# Altium schematic sheet Micro-Controller Unit.SchDoc: Micro Controller Unit
size A3; DrawnBy: Adrien Dos SANTOS; Organization: Altium Limited; Revision: revision; SheetNumber: 2; SheetTotal: 5; ProjectName: projname
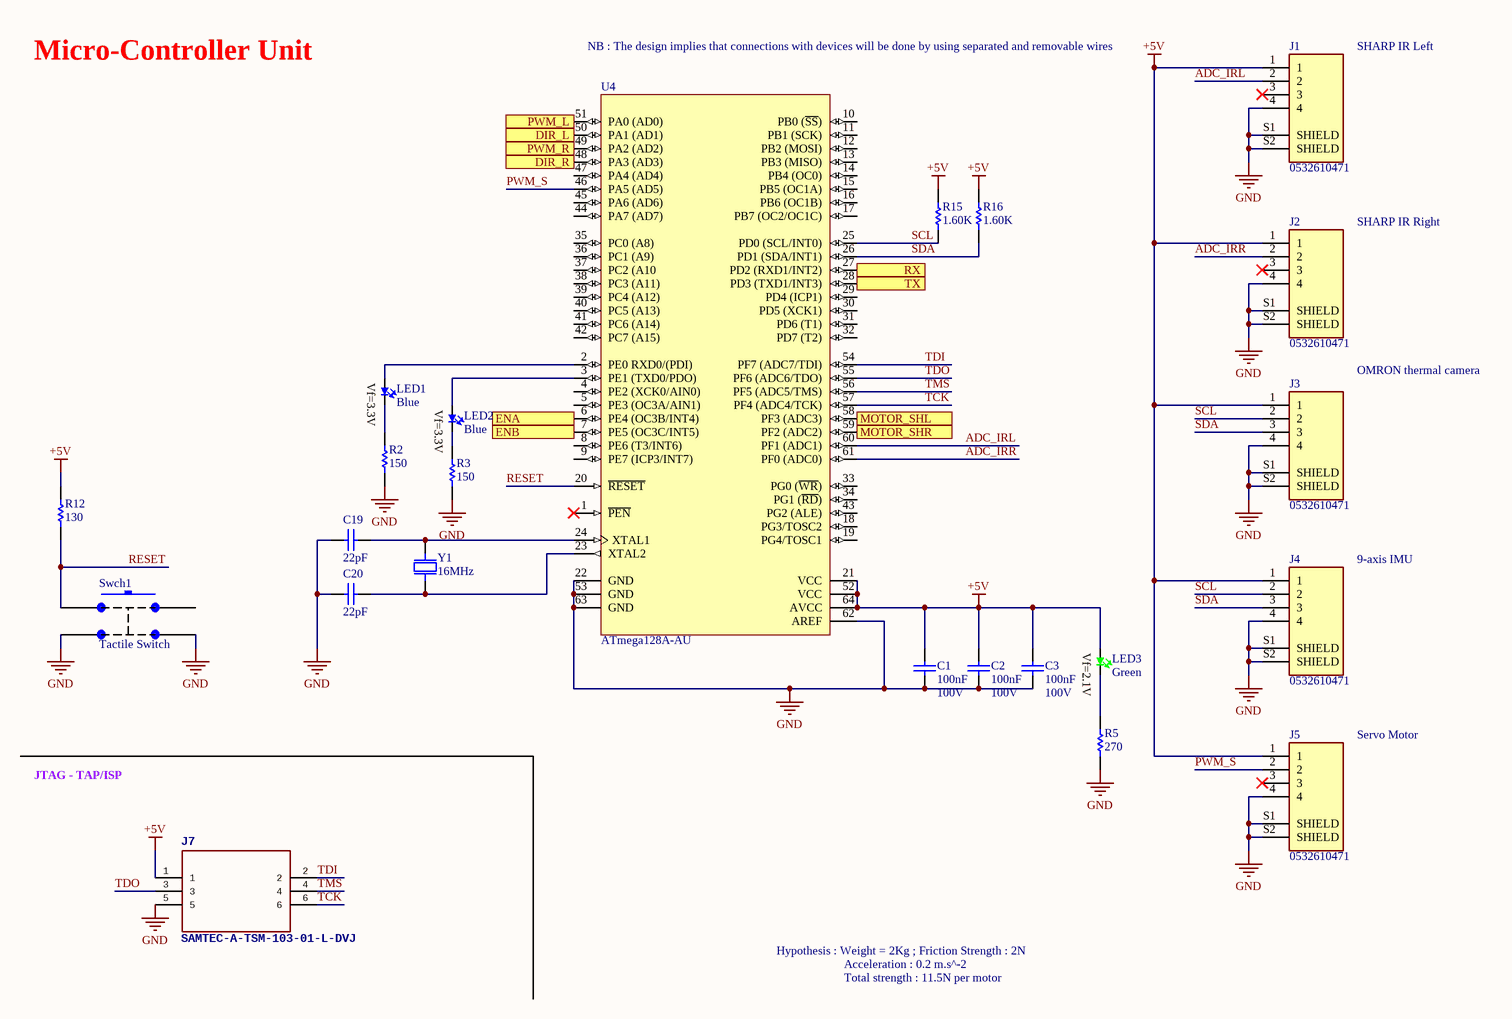
[diagram p0: Micro-Controller Unit.SchDoc]

## Parts
C1  value 100nF  Voltage - Rated: 100V  [CC0603 x 0.95mm]  (hidden comment: CAP)
C2  value 100nF  Voltage - Rated: 100V  [CC0603 x 0.95mm]  (hidden comment: CAP)
C3  value 100nF  Voltage - Rated: 100V  [CC0603 x 0.95mm]  (hidden comment: CAP)
C19  value 22pF  [CC0201 x 0.33mm]  (hidden comment: CAP)
C20  value 22pF  [CC0201 x 0.33mm]  (hidden comment: CAP)
J1  0532610471  [MOLEX_0532610471]
J2  0532610471  [MOLEX_0532610471]
J3  0532610471  [MOLEX_0532610471]
J4  0532610471  [MOLEX_0532610471]
J5  0532610471  [MOLEX_0532610471]
J7  SAMTEC-A-TSM-103-01-L-DVJ  [SAMTEC-A-TSM-103-01-L-DV]
LED1  Blue  [LED 0603 WHITE]
LED2  Blue  [LED 0603 WHITE]
LED3  Green  [LED 0603 GREEN]
R2  value 150  [RESC0603_N]  (hidden comment: RES)
R3  value 150  [RESC0603_N]  (hidden comment: RES)
R5  value 270  [RESC0603_N]  (hidden comment: RES)
R12  value 130  [RESC0603_N]  (hidden comment: RES)
R15  value 1.60K  [RESC0603_N]  (hidden comment: RES)
R16  value 1.60K  [RESC0603_N]  (hidden comment: RES)
Swch1  Tactile Switch  [Tactile Switch - 1825910_6]
U4  ATmega128A-AU  [64A_N]
Y1  16MHz  [ABM3]

## Ports
DIR_L (out), DIR_R (out), ENA (out), ENB (out), MOTOR_SHL (in), MOTOR_SHR (in), PWM_L (out), PWM_R (out), RX (in), TX (out)

## Nets
+5V: C1.2 C2.2 C3.2 J1.1 J2.1 J3.1 J4.1 J5.1 J7.1 LED3.2(A) R12.2 R15.2 R16.2 U4.21(VCC) U4.52(VCC) U4.64(AVCC)
GND: C1.1 C2.1 C3.1 C19.1 C20.1 J1.4 J1.S1(SHIELD) J1.S2(SHIELD) J2.4 J2.S1(SHIELD) J2.S2(SHIELD) J3.4 J3.S1(SHIELD) J3.S2(SHIELD) J4.4 J4.S1(SHIELD) J4.S2(SHIELD) J5.4 J5.S1(SHIELD) J5.S2(SHIELD) J7.5 R2.1 R3.1 R5.1 Swch1.3(out) Swch1.4(out) U4.22(GND) U4.53(GND) U4.62(AREF) U4.63(GND)
ADC_IRL: J1.2 U4.60(PF1_(ADC1))
ADC_IRR: J2.2 U4.61(PF0_(ADC0))
DIR_L: U4.50(PA1_(AD1)) ; port DIR_L
DIR_R: U4.48(PA3_(AD3)) ; port DIR_R
ENA: U4.6(PE4_(OC3B/INT4)) ; port ENA
ENB: U4.7(PE5_(OC3C/INT5)) ; port ENB
MOTOR_SHL: U4.58(PF3_(ADC3)) ; port MOTOR_SHL
MOTOR_SHR: U4.59(PF2_(ADC2)) ; port MOTOR_SHR
PWM_L: U4.51(PA0_(AD0)) ; port PWM_L
PWM_R: U4.49(PA2_(AD2)) ; port PWM_R
PWM_S: J5.2 U4.46(PA5_(AD5))
RESET: R12.1 Swch1.1(in) U4.20(~{RESET})
RX: U4.27(PD2_(RXD1/INT2)) ; port RX
SCL: J3.2 J4.2 R15.1 U4.25(PD0_(SCL/INT0))
SDA: J3.3 J4.3 R16.1 U4.26(PD1_(SDA/INT1))
TCK: J7.6 U4.57(PF4_(ADC4/TCK))
TDI: J7.2 U4.54(PF7_(ADC7/TDI))
TDO: J7.3 U4.55(PF6_(ADC6/TDO))
TMS: J7.4 U4.56(PF5_(ADC5/TMS))
TX: U4.28(PD3_(TXD1/INT3)) ; port TX
NetC19_2: C19.2 U4.24(XTAL1) Y1.2
NetC20_2: C20.2 U4.23(XTAL2) Y1.1
NetLED1_1: LED1.1(K) R2.2
NetLED1_2: LED1.2(A) U4.2(PE0_RXD0/(PDI))
NetLED2_1: LED2.1(K) R3.2
NetLED2_2: LED2.2(A) U4.3(PE1_(TXD0/PDO))
NetLED3_1: LED3.1(K) R5.2

Not connected (* = marked no-connect by the designer): J1 3*; J2 3*; J5 3*; Swch1 2(in); U4 1(~{PEN})* 4(PE2_(XCK0/AIN0)) 5(PE3_(OC3A/AIN1)) 8(PE6_(T3/INT6)) 9(PE7_(ICP3/INT7)) 10(PB0_(~{SS})) 11(PB1_(SCK)) 12(PB2_(MOSI)) 13(PB3_(MISO)) 14(PB4_(OC0)) 15(PB5_(OC1A)) 16(PB6_(OC1B)) 17(PB7_(OC2/OC1C)) 18(PG3/TOSC2) 19(PG4/TOSC1) 29(PD4_(ICP1)) 30(PD5_(XCK1)) 31(PD6_(T1)) 32(PD7_(T2)) 33(PG0_(~{WR})) 34(PG1_(~{RD})) 35(PC0_(A8)) 36(PC1_(A9)) 37(PC2_(A10) 38(PC3_(A11)) 39(PC4_(A12)) 40(PC5_(A13)) 41(PC6_(A14)) 42(PC7_(A15)) 43(PG2_(ALE)) 44(PA7_(AD7)) 45(PA6_(AD6)) 47(PA4_(AD4))

## Notes on the sheet
- Micro-Controller Unit
- NB : The design implies that connections with devices will be done by using separated and removable wires
- SHARP IR Left
- SHARP IR Right
- OMRON thermal camera
- 9-axis IMU
- JTAG - TAP/ISP
- Servo Motor
- Hypothesis : Weight = 2Kg ; Friction Strength : 2N
- Acceleration : 0.2 m.s^-2
- Total strength : 11.5N per motor
- Title
- Size:
- Date:
- A3
- Revision:
- Time:
- Sheet
- of
- Avnet EMG France SA
- 12 rue Jean Bart
- 91120 MASSY - FR
- File:
- Drawn by :
- (in symbol KP-1608CGCK) Vf=2.1V
- (in symbol KP-1608QBC-D) Vf=3.3V

## Library data of the parts
C1-C3 = CS0603KRX7R0BB104: 0.1µF ±10% 100V Ceramic Capacitor X7R 0603 (1608 Metric); manufacturer: Yageo; Manufacturer Standard Lead Time: 17 Weeks; currency: USD; idx: 2943; Package Inch: 0603; Package Metric: 1608; Normalized value µF: 0.1; Part Number: CS0603KRX7R0BB104; price: *; Rated Voltage: *; Tolerance: ±10%; Temperature Coefficient: X7R; MOQ: *; ComponentLink1URL: http://www.yageo.com/NewPortal/yageodocoutput?fileName=/pdf/MLCC/UPY-ST_NPOX7R_16V-to-3KV_5.pdf; ProductLink: https://www.digikey.com/product-detail/en/yageo/CS0603KRX7R0BB104/311-3555-2-ND/6097976; Digi-Key Part Number: 311-3555-2-ND; Operating Temperature: -55°C ~ 125°C; Lead Free Status / RoHS Status: Lead free / ROHS3 Compliant; Mounting Type: Surface Mount, MLCC; Size / Dimension: 0.063" L x 0.031" W (1.60mm x 0.80mm); Thickness (Max): 0.037" (0.95mm); Thickness mm: 0.95; Thickness Inch: 0.037; Length Inch: 0.063; Width Inch: 0.031; Length mm: 1.60; Width mm: 0.80; Series: CS; Part Status: Active; Package / Case: 0603 (1608 Metric); Lead Style: -; Packaging: Tape & Reel (TR); Moisture Sensitivity Level (MSL): 1  (Unlimited); Applications: Boardflex Sensitive; Height - Seated (Max): -; Lead Spacing: -; Capacitance: 0.1µF; Features: Soft Termination; Ratings: -; Failure Rate: -
C19 C20 = CC0201GRNPO9BN220: 22pF ±2% 50V Ceramic Capacitor C0G, NP0 0201 (0603 Metric); manufacturer: Yageo; Manufacturer Standard Lead Time: 17 Weeks; currency: USD; idx: 21136; Package Inch: 0201; Package Metric: 0603; Normalized value µF: 2.2E-5; Part Number: CC0201GRNPO9BN220; price: *; Rated Voltage: *; Tolerance: ±2%; Temperature Coefficient: C0G, NP0; MOQ: *; Voltage - Rated: 50V; ComponentLink1URL: https://www.yageo.com/upload/media/product/productsearch/datasheet/mlcc/UPY-GP_NP0_16V-to-50V_17.pdf; ProductLink: https://www.digikey.com/product-detail/en/yageo/CC0201GRNPO9BN220/311-3681-2-ND/5883130; Digi-Key Part Number: 311-3681-2-ND; Operating Temperature: -55°C ~ 125°C; Lead Free Status / RoHS Status: Lead free / ROHS3 Compliant; Mounting Type: Surface Mount, MLCC; Size / Dimension: 0.024" L x 0.012" W (0.60mm x 0.30mm); Thickness (Max): 0.013" (0.33mm); Thickness mm: 0.33; Thickness Inch: 0.013; Length Inch: 0.024; Width Inch: 0.012; Length mm: 0.60; Width mm: 0.30; Series: CC; Part Status: Active; Package / Case: 0201 (0603 Metric); Lead Style: -; Packaging: Tape & Reel (TR); Moisture Sensitivity Level (MSL): 1  (Unlimited); ComponentLink1Description: Datasheet; Applications: General Purpose; Height - Seated (Max): -; Lead Spacing: -; Capacitance: 22pF; Features: -; Ratings: -; Failure Rate: -
J1-J5 = 0532610471: Picoblade Connector, 4 Circuit Single Row, Right Angle Surface Mount SMT PCB; MF: Molex; MP: 0532610471; Digi-Key_Purchase_URL: https://www.digikey.com/product-detail/en/molex/0532610471/WM7622CT-ND/699109?utm_source=snapeda&utm_medium=aggregator&utm_campaign=symbol; Package: None; Digi-Key_Part_Number: WM7622CT-ND; Value: *; SnapEDA_Link: https://www.snapeda.com/parts/0532610471/Molex/view-part/542805/?ref=snap
LED1 LED2 = KP-1608QBC-D: 1.6 mm x 0.8 mm Blue SMD Top LED; Manufacturer: Kingbright; currency: EUR; Lens Colour: Clear; Viewing Angle: 120°; Lens Style: Diffused,Colorless,Circular,Rectangular; Number of LEDs: 1; Wavelength: 465nm; Luminous Intensity: 100mcd; Forward Voltage: 3.3V; Dominant Wavelength: 470nm; Forward Current: 20mA; Avnet Part Number: KINKP1608QBCD; Price: 0.0419; MOQ: 2000; Supplier 1: Element14; Part Number: KP-1608QBC-D; Stock 1: 2000; Mount: Surface Mount; Case/Package: 1608; Number of Pins: 2; Colour: Blue; Packaging: Tape and Reel; Length: 0.8mm; Height: 1.1mm; Width: 1.6mm; Radiation Hardening: No; REACH SVHC: No SVHC; ComponentLink1URL: https://datasheet.ciiva.com/8060/1655842-8060422.pdf; ComponentLink1Description: https://datasheet.ciiva.com/8060/1655842-8060422.pdf; ComponentLink2URL: https://datasheet.ciiva.com/41454/001050379-da-01-en-smd-chipled-bl-0603-kp-1608qbc-d-41454603.pdf; ComponentLink2Description: https://datasheet.ciiva.com/41454/001050379-da-01-en-smd-chipled-bl-0603-kp-1608qbc-d-41454603.pdf; Supplier Part Number 1: 2449779
LED3 = KP-1608CGCK: 1.6 mm x 0.8 mm Green SMD Top LED; Manufacturer: Kingbright; Lens Colour: Clear; Viewing Angle: 120°; Lens Style: Diffused,Colorless,Rectangular; Dominant Wavelength: 570nm; Number of LEDs: 1; Luminous Intensity: 50mcd; Forward Voltage: 2.1V; Forward Current: 20mA; currency: EUR; Supplier 1: Element14; Part Number: KP-1608CGCK; Stock 1: 0; Mount: Surface Mount; Case/Package: 1608; Number of Pins: 2; Colour: Green; Wavelength: 570nm; Packaging: Tape and Reel; Length: 0.8mm; Height: 1.1mm; Width: 1.6mm; Radiation Hardening: No; REACH SVHC: No SVHC; ComponentLink1URL: https://datasheet.ciiva.com/8060/1683493-8060417.pdf; ComponentLink1Description: https://datasheet.ciiva.com/8060/1683493-8060417.pdf; ComponentLink2URL: https://datasheet.ciiva.com/20166/72-8670-20166923.pdf; ComponentLink2Description: https://datasheet.ciiva.com/20166/72-8670-20166923.pdf; Avnet Part Number: KINKPG1608CGKCT; Price: 0.0323; MOQ: 4000
R2 R3 = RC0603FR-07150RL: RES 150 OHM 1/10W 1% 0603 SMD; manufacturer: Yageo; currency: USD; Rated Power: 0.1W, 1/10W; smt_res_0603id: 72883; sub_category_id: 619; category_id: 33; Temperature Coefficient: ±100ppm/°C; lead_style: Surface Mount (SMD - SMT); Value Unit: 1; MOQ: 5.000; Part Number: RC0603FR-07150RL; price: 0.00270; image: http://media.digikey.com/Renders/Yageo%20Renders/RC0603FR-0710RL_tmb.jpg; Digikey PN: 311-150HRTR-ND; series: RC0603; composition: Thick Film; features: -; Tolerance: ±1%; Case: 0603 (1608 metric); Size Dimension: 0.063" L x 0.031" W (1.60mm x 0.80mm); Height: 0.018" (0.45mm); packaging: Tape & Reel (TR); quantity_available: 970,000Note / Alternate Packaging; datasheet: http://www.yageo.com/pdf/Pu-RC0603_51_PbFree_L_2.pdf; Normalized Value: 150; Display Value: 150; Value_in_ohm: 150
R5 = RT0603BRE07270RL: RES 270 OHM 1/10W .1% SMD 0603; manufacturer: Yageo; currency: USD; Rated Power: 0.1W, 1/10W; smt_res_0603id: 163901; sub_category_id: 619; category_id: 33; Temperature Coefficient: ±50ppm/°C; Tolerance: ±0.1%; lead_style: Surface Mount (SMD - SMT); Value Unit: 1; MOQ: 5.000; Part Number: RT0603BRE07270RL; price: 0.11300; image: http://media.digikey.com/Renders/Yageo%20Renders/RC0603FR-0710RL_tmb.jpg; Digikey PN: RT0603BRE07270RL-ND; series: RT; composition: Thin Film; features: -; Case: 0603 (1608 metric); Size Dimension: 0.063" L x 0.031" W (1.60mm x 0.80mm); Height: 0.018" (0.45mm); packaging: Tape & Reel (TR); quantity_available: 0; datasheet: http://www.yageo.com/pdf/PYu-RT_1-to-0.05_RoHS_L_3.pdf; Normalized Value: 270; Display Value: 270; Value_in_ohm: 270
R12 = RC0603FR-07130RL: RES 130 OHM 1/10W 1% 0603 SMD; manufacturer: Yageo; currency: USD; Rated Power: 0.1W, 1/10W; smt_res_0603id: 142960; sub_category_id: 619; category_id: 33; Temperature Coefficient: ±100ppm/°C; lead_style: Surface Mount (SMD - SMT); Value Unit: 1; MOQ: 5.000; Part Number: RC0603FR-07130RL; price: 0.00270; image: http://media.digikey.com/Renders/Yageo%20Renders/RC0603FR-0710RL_tmb.jpg; Digikey PN: 311-130HRTR-ND; series: RC0603; composition: Thick Film; features: -; Tolerance: ±1%; Case: 0603 (1608 metric); Size Dimension: 0.063" L x 0.031" W (1.60mm x 0.80mm); Height: 0.018" (0.45mm); packaging: Tape & Reel (TR); quantity_available: 0Note / Alternate Packaging; datasheet: http://www.yageo.com/pdf/Pu-RC0603_51_PbFree_L_2.pdf; Normalized Value: 130; Display Value: 130; Value_in_ohm: 130
R15 R16 = RC0603FR-071K6L: RES 1.60K OHM 1/10W 1% 0603 SMD; manufacturer: Yageo; currency: USD; Rated Power: 0.1W, 1/10W; smt_res_0603id: 73222; sub_category_id: 619; category_id: 33; Temperature Coefficient: ±100ppm/°C; lead_style: Surface Mount (SMD - SMT); Value Unit: 1000; Normalized Value: 1.6; Display Value: 1.6K; Value_in_ohm: 1600; MOQ: 5.000; Part Number: RC0603FR-071K6L; price: 0.00270; image: http://media.digikey.com/Renders/Yageo%20Renders/RC0603FR-0710RL_tmb.jpg; Digikey PN: 311-1.60KHRTR-ND; series: RC0603; composition: Thick Film; features: -; Tolerance: ±1%; Case: 0603 (1608 metric); Size Dimension: 0.063" L x 0.031" W (1.60mm x 0.80mm); Height: 0.018" (0.45mm); packaging: Tape & Reel (TR); quantity_available: 0Note / Alternate Packaging; datasheet: http://www.yageo.com/pdf/Pu-RC0603_51_PbFree_L_2.pdf
U4 = ATmega128A-AU: 8-bit AVR Microcontroller, 128KB Flash, 4KB EEPROM, 4KB SRAM, 64-pin TQFP, Industrial Grade (-40°C to 85°C); Published: 1-Apr-2010; DatasheetVersion: revE, Feb-2010; PackageVersion: revB, Oct-2001; PackageReference: 64A; Publisher: Altium Limited; PackageDescription: 64-Pin Plastic Thin Profile Quad Flat Pack, 14 x 14 x 1.0 mm Body, 0.8 mm Pitch (TQFP); Supplier 1: Digi-Key; Supplier Part Number 1: ATMEGA128A-AU-ND; Supplier 2: Farnell; Supplier Part Number 2: 1773397; Supplier 3: Mouser; Supplier Part Number 3: 556-ATMEGA128A-AU; Code_JEDEC: MS-026-AEB; ComponentLink1Description: Manufacturer Link; ComponentLink1URL: http://www.atmel.com/products/avr/default.asp?; ComponentLink2Description: ATmega128A Datasheet; ComponentLink2URL: http://www.atmel.com/dyn/resources/prod_documents/doc8151.pdf; ComponentLink3Description: ATmega128A Summary; ComponentLink3URL: http://www.atmel.com/dyn/resources/prod_documents/8151S.pdf; ComponentLink4Description: Atmel.com Home; ComponentLink4URL: http://www.atmel.com
Y1 = ABM3-8.000MHZ-D2Y-T: 5.0 X 3.2 X 1.3mm Crystal 8MHz, CL 18pF, 20ppm; Manufacturer: Abracon; ESR (Equivalent Series Resistance): 500R; Frequency Stability: 30ppm; currency: EUR; Supplier 1: Digi-Key; Part Number: ABM3-8.000MHZ-D2Y-T; Stock 1: 26000; Price: 0.1441; Mount: Surface Mount; Case/Package: CSMD; Number of Pins: 2; Min Operating Temperature: -40°C; Max Operating Temperature: 85°C; Frequency: 8MHz; Tolerance: 20ppm; Load Capacitance: 18pF; Packaging: Tape and Reel; Package Quantity: 1000; Frequency Tolerance: 20ppm; Termination: SMD/SMT; Composition: Ceramic; Series Resistance: 500R; Length: 5mm; Height: 0.051inch; Width: 3.2mm; Depth: 3.2mm; Radiation Hardening: No; REACH SVHC: Unknown; Lead Free: Lead Free; ComponentLink1URL: https://datasheet.ciiva.com/4945/abm3-47699-4945424.pdf; ComponentLink1Description: https://datasheet.ciiva.com/4945/abm3-47699-4945424.pdf; ComponentLink2URL: https://datasheet.ciiva.com/5788/abm3-5788043.pdf; ComponentLink2Description: https://datasheet.ciiva.com/5788/abm3-5788043.pdf; ComponentLink3URL: https://datasheet.ciiva.com/26812/getdatasheetpartid-723821-26812186.pdf; ComponentLink3Description: https://datasheet.ciiva.com/26812/getdatasheetpartid-723821-26812186.pdf; ComponentLink4URL: https://datasheet.ciiva.com/7998/abm3-7998589.pdf; ComponentLink4Description: https://datasheet.ciiva.com/7998/abm3-7998589.pdf; ComponentLink5URL: https://datasheet.ciiva.com/16392/abm3-16392475.pdf; ComponentLink5Description: https://datasheet.ciiva.com/16392/abm3-16392475.pdf; ComponentLink6URL: https://datasheet.ciiva.com/3174/abm3-3174137.pdf; ComponentLink6Description: https://datasheet.ciiva.com/3174/abm3-3174137.pdf; ComponentLink7URL: https://datasheet.ciiva.com/862/abm3-862466.pdf; ComponentLink7Description: https://datasheet.ciiva.com/862/abm3-862466.pdf; ComponentLink8URL: https://datasheet.ciiva.com/862/abm3-862465.pdf; ComponentLink8Description: https://datasheet.ciiva.com/862/abm3-862465.pdf; ComponentLink9URL: https://datasheet.ciiva.com/1357/1754353-1357270.pdf; ComponentLink9Description: https://datasheet.ciiva.com/1357/1754353-1357270.pdf; ComponentLink10URL: https://datasheet.ciiva.com/862/abm3-862467.pdf; ComponentLink10Description: https://datasheet.ciiva.com/862/abm3-862467.pdf; Avnet Part Number: ABRABM38000MHZD2YT; MOQ: 1000